# Altium schematic sheet ICM_20948.SchDoc
size A4
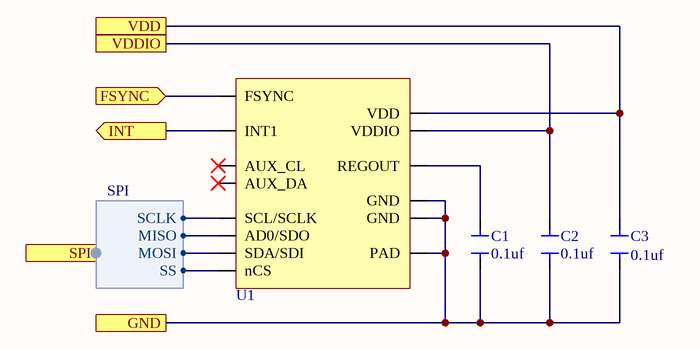
[diagram p0: ICM_20948.SchDoc]

## Parts
C1  value 0.1uf  [CAP_0402]  (hidden comment: Cap)
C2  value 0.1uf  [CAP_0402]  (hidden comment: Cap)
C3  value 0.1uf  [CAP_0402]  (hidden comment: Cap)
U1  ICM-20948  [QFN_24_3X3]  (value not drawn)

## Ports
FSYNC (in), GND, INT (out), SPI (harness SPI), VDD, VDDIO

## Harnesses
SPI: SS, SCLK, MISO, MOSI

## Nets
FSYNC: U1.11(FSYNC) ; port FSYNC
GND: C1.2 C2.2 C3.2 U1.18(GND) U1.20(GND) U1.25(PAD) ; port GND
INT: U1.12(INT1) ; port INT
VDD: C3.1 U1.13(VDD) ; port VDD
VDDIO: C2.1 U1.8(VDDIO) ; port VDDIO
NetC1_1: C1.1 U1.10(REGOUT)
NetU1_9: U1.9(AD0/SDO) ; port SPI.MISO
NetU1_22: U1.22(nCS) ; port SPI.SS
NetU1_23: U1.23(SCL/SCLK) ; port SPI.SCLK
NetU1_24: U1.24(SDA/SDI) ; port SPI.MOSI

Not connected (* = marked no-connect by the designer): U1 7(AUX_CL)* 21(AUX_DA)*

## Library data of the parts
U1 = ICM-20948: Accelerometer, Gyroscope, Magnetometer, 9 Axis Sensor IÂ²C, SPI Output; MF: TDK InvenSense; Availability: Unavailable; SnapEDA_Link: https://www.snapeda.com/parts/ICM-20948/TDK%20InvenSense/view-part/578927/?ref=snap; Price: None; Value: *; Package: QFN-24 InvenSense; MP: ICM-20948